# EAGLE schematic Gesture_rf_controller_v1 (EAGLE 7.1.0)
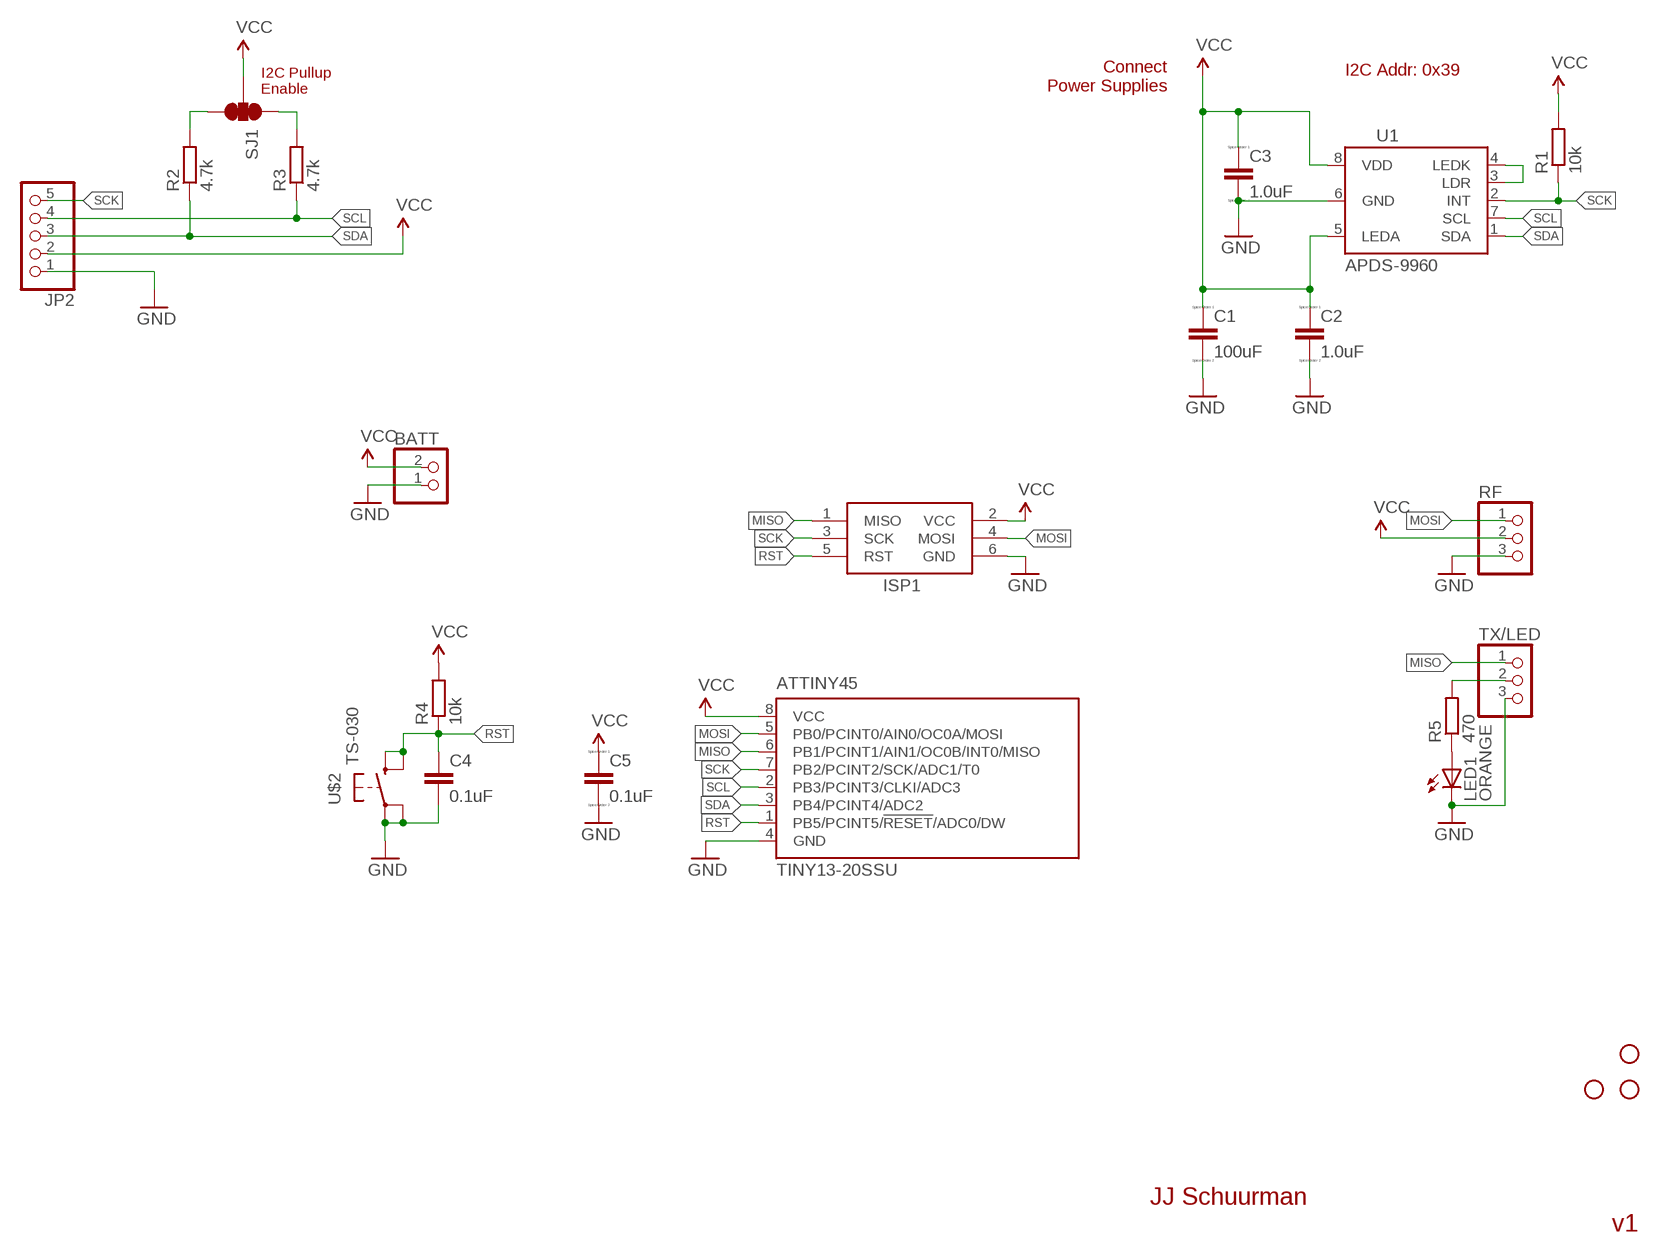
[diagram p0: schematic, sheet 1]

## Parts
ATTINY45  TINY13-20SSU  [8S1]
BATT  JST_2PIN-THM  [JST-PH-2-THM]
C1  100uF  C-EUC0805  [C0805]
C2  1.0uF  C-EUC0805  [C0805]
C3  1.0uF  C-EUC0805  [C0805]
C4  0.1uF  C-EUC1206  [C1206]
C5  0.1uF  C-EUC0805  [C0805]
ISP1  AVRISP-6  [AVRISP]
JP2  PINHD-1X5  [1X05]
LED1  ORANGE  LEDCHIP-LED0805  [CHIP-LED0805]
R1  10k  R-EU_R0805  [R0805]
R2  4.7k  R-EU_R1206  [R1206]
R3  4.7k  R-EU_R1206  [R1206]
R4  10k  R-EU_M0805  [M0805]
R5  470  R-EU_R0805  [R0805]
RF  PINHD-1X3  [1X03]
SJ1  SOLDERJUMPER_2WAYPASTE1&2&3  [SJ_3_PASTE1&2&3]
STANDOFF1  STAND-OFF  [STAND-OFF]
STANDOFF2  STAND-OFF  [STAND-OFF]
STANDOFF4  STAND-OFF  [STAND-OFF]
TX/LED  PINHD-1X3  [1X03]
U1  APDS-9960  [APDS-9960]
U$2  TS-030  [TS-030]

## Nets
GND: ATTINY45.4(GND) BATT.1 C1.2 C2.2 C3.2 C4.2 C5.2 ISP1.6(GND) JP2.1 LED1.C RF.3 TX/LED.3 U1.6(GND) U$2.P$2 U$2.P$3
MISO: ATTINY45.6(PB1/PCINT1/AIN1/OC0B/INT0/MISO) ISP1.1(MISO) TX/LED.1
MOSI: ATTINY45.5(PB0/PCINT0/AIN0/OC0A/MOSI) ISP1.4(MOSI) RF.1
N$1: R2.2 SJ1.3
N$2: R3.2 SJ1.1
N$3: LED1.A R5.1
N$4: U1.3(LDR) U1.4(LEDK)
RST: ATTINY45.1(PB5/PCINT5/!RESET!/ADC0/DW) C4.1 ISP1.5(RST) R4.1 U$2.P$1 U$2.P$4
SCK: ATTINY45.7(PB2/PCINT2/SCK/ADC1/T0) ISP1.3(SCK) JP2.5 R1.1 U1.2(INT)
SCL: ATTINY45.2(PB3/PCINT3/CLKI/ADC3) JP2.4 R3.1 U1.7(SCL)
SDA: ATTINY45.3(PB4/PCINT4/ADC2) JP2.3 R2.1 U1.1(SDA)
TX/LED: R5.2 TX/LED.2
VCC: ATTINY45.8(VCC) BATT.2 C1.1 C2.1 C3.1 C5.1 ISP1.2(VCC) JP2.2 R1.2 R4.2 RF.2 SJ1.2 U1.5(LEDA) U1.8(VDD)

## Notes on the sheet
- Connect
  Power Supplies
- I2C Addr: 0x39
- I2C Pullup
  Enable
- JJ Schuurman
- v1

## Library data of the parts
ATTINY45 = atmel:TINY13: 8-bit AVR Microcontroller with 1K Bytes In-System Programmable Flash Source: http://www.atmel.com/dyn/resources/prod_documents/2535S.pdf; MPN: ATTINY13-20SSU; OC_FARNELL: 1455133; OC_NEWARK: 58M3771
BATT = adafruit:JST_2PIN: JST 2-Pin Connectors of various flavors SMT-RA (S2B-PH-SM4) 4UConnector #17311 SMT (B2B-PH-SM4) THM-RA (S2B-PH) THM (B2B-PH)
C1-C3 C5 = resistor:C-EU: CAPACITOR, European symbol; SPICEPREFIX: C
C4 = rcl:C-EU: CAPACITOR, European symbol
ISP1 = adafruit:AVRISP: AVR ISP HEADER Standard 6 pin header for AVR programming
JP2 = pinhead:PINHD-1X5: PIN HEADER
LED1 = adafruit:LED: LED OSRAM: - CHIPLED LG R971, LG N971, LY N971, LG Q971, LY Q971, LO R971, LY R971 LH N974, LH R974 LS Q976, LO Q976, LY Q976 LO Q996 - Hyper CHIPLED LW Q18S LB Q993, LB Q99A, LB R99A - SideLED LS A670, LO A670, LY A670, LG A670, LP A670 LB A673, LV A673, LT A673, LW A673 LH A674 LY A675 LS A676, LA A676, LO A676, LY A676, LW A676 LS A679, LY A679, LG A679 - Hyper Micro SIDELED® LS Y876, LA Y876, LO Y876, LY Y876 LT Y87S - SmartLED LW L88C, LW L88S LB L89C, LB L89S, LG L890 LS L89K, LO L89K, LY L89K LS L896, LA L896, LO L896, LY L896 - TOPLED LS T670, LO T670, LY T670, LG T670, LP T670 LSG T670, LSP T670, LSY T670, LOP T670, LYG T670 LG T671, LOG T671, LSG T671 LB T673, LV T673, LT T673, LW T673 LH T674 LS T676, LA T676, LO T676, LY T676, LB T676, LH T676, LSB T676, LW T676 LB T67C, LV T67C, LT T67C, LS T67K, LO T67K, LY T67K, LW E67C LS E67B, LA E67B, LO E67B, LY E67B, LB E67C, LV E67C, LT E67C LW T67C LS T679, LY T679, LG T679 LS T770, LO T770, LY T770, LG T770, LP T770 LB T773, LV T773, LT T773, LW T773 LH T774 LS E675, LA E675, LY E675, LS T675 LS T776, LA T776, LO T776, LY T776, LB T776 LHGB T686 LT T68C, LB T68C - Hyper Mini TOPLED® LB M676 - Mini TOPLED Santana® LG M470 LS M47K, LO M47K, LY M47K Source: http://www.osram.convergy.de/
R1-R5 = resistor:R-EU_: RESISTOR, European symbol
RF TX/LED = pinhead:PINHD-1X3: PIN HEADER
SJ1 = SparkFun-Passives:SOLDERJUMPER_2WAY: Solder Jumper 2 way solder jumper
STANDOFF1 STANDOFF2 STANDOFF4 = SparkFun-Electromechanical:STAND-OFF: #4 Stand Off This is the mechanical footprint for a #4 phillips button head screw. Use the keepout ring to avoid running the screw head into surrounding components. SKU : PRT-00447
U1 = SparkFun-Sensors:APDS-9960: Avago APDS-9960 digital proximity, ambient light, RGB, and gesture sensor.; PROD_ID: SEN-12005
U$2 = switch-tact:TS-030

## Net classes
1 VCC: width 0.381 mm